# Altium schematic sheet CHipKIT_IO.SchDoc
size A
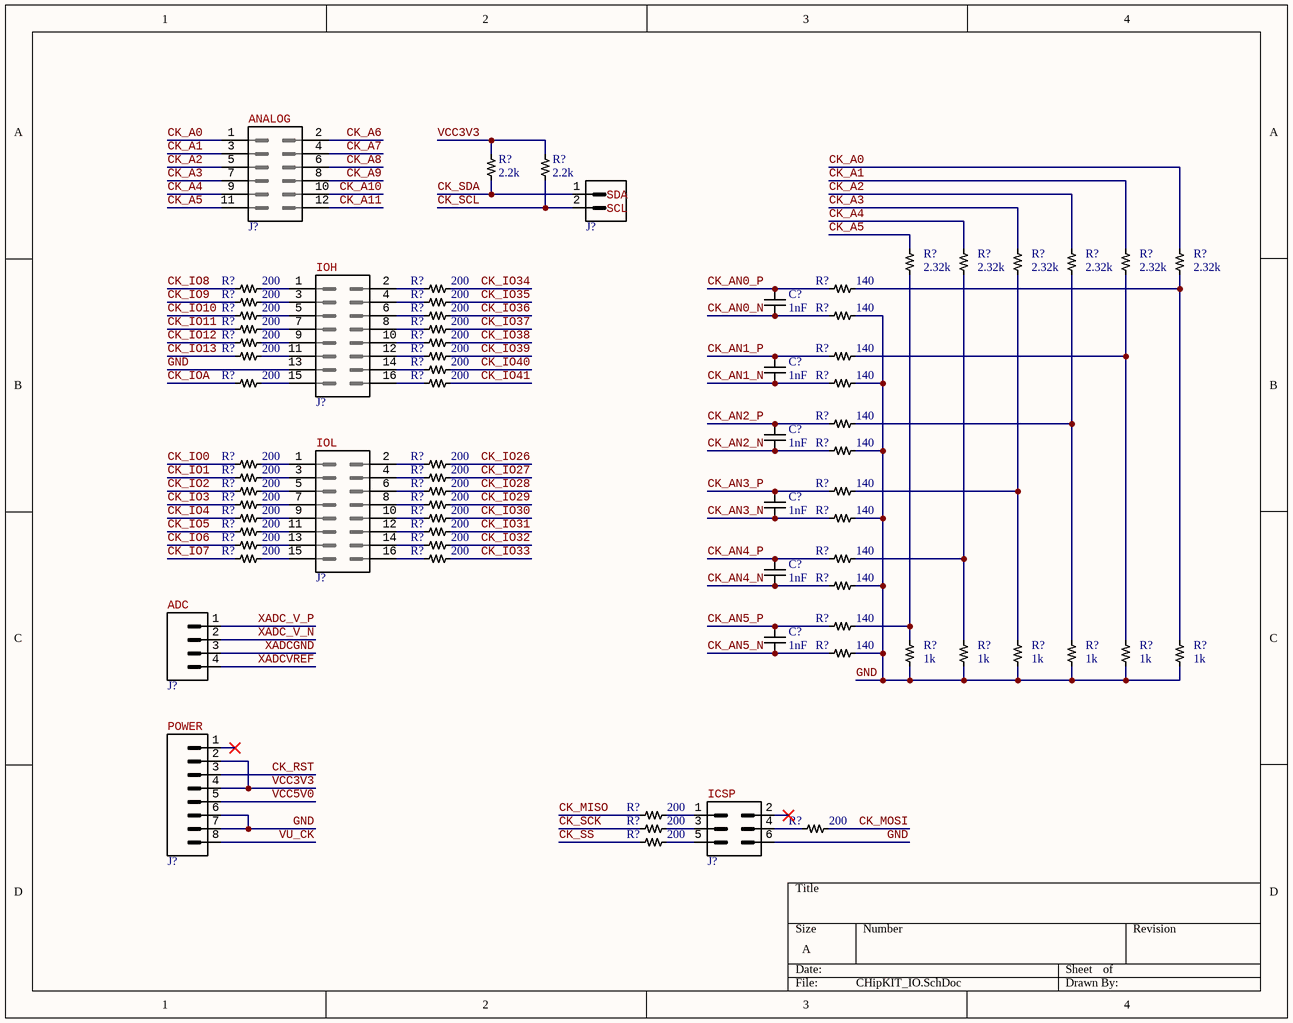
[diagram p0: CHipKIT_IO.SchDoc]

## Parts
(Parts that share a designator on the sheet are numbered #1, #2 ... from top to bottom, then left to right.)
C?#1  1nF  [CAP0402]
C?#2  1nF  [CAP0402]
C?#3  1nF  [CAP0402]
C?#4  1nF  [CAP0402]
C?#5  1nF  [CAP0402]
C?#6  1nF  [CAP0402]
J?#1  2x6 Header  [HEADER_2X6]  (value not drawn)
J?#2  1x2 Header  [HEADER_1X2]  (value not drawn)
J?#3  2x8 Header  [HEADER_2x8]  (value not drawn)
J?#4  2x8 Header  [HEADER_2x8]  (value not drawn)
J?#5  1x4 Header  [HEADER_1X4]  (value not drawn)
J?#6  1x8 Header  [HEADER_1X8]  (value not drawn)
J?#7  2x3 Header  [HEADER_2X3]  (value not drawn)
R?#1  2.2k  [RES0402]
R?#2  2.2k  [RES0402]
R?#3  2.32k  [RES0402]
R?#4  2.32k  [RES0402]
R?#5  2.32k  [RES0402]
R?#6  2.32k  [RES0402]
R?#7  2.32k  [RES0402]
R?#8  2.32k  [RES0402]
R?#9  200  [RES0402]
R?#10  200  [RES0402]
R?#11  140  [RES0402]
R?#12  200  [RES0402]
R?#13  200  [RES0402]
R?#14  200  [RES0402]
R?#15  200  [RES0402]
R?#16  140  [RES0402]
R?#17  200  [RES0402]
R?#18  200  [RES0402]
R?#19  200  [RES0402]
R?#20  200  [RES0402]
R?#21  200  [RES0402]
R?#22  200  [RES0402]
R?#23  140  [RES0402]
R?#24  200  [RES0402]
R?#25  200  [RES0402]
R?#26  200  [RES0402]
R?#27  140  [RES0402]
R?#28  140  [RES0402]
R?#29  140  [RES0402]
R?#30  200  [RES0402]
R?#31  200  [RES0402]
R?#32  200  [RES0402]
R?#33  200  [RES0402]
R?#34  200  [RES0402]
R?#35  200  [RES0402]
R?#36  140  [RES0402]
R?#37  200  [RES0402]
R?#38  200  [RES0402]
R?#39  200  [RES0402]
R?#40  200  [RES0402]
R?#41  140  [RES0402]
R?#42  200  [RES0402]
R?#43  200  [RES0402]
R?#44  200  [RES0402]
R?#45  200  [RES0402]
R?#46  200  [RES0402]
R?#47  200  [RES0402]
R?#48  140  [RES0402]
R?#49  140  [RES0402]
R?#50  140  [RES0402]
R?#51  140  [RES0402]
R?#52  1k  [RES0402]
R?#53  1k  [RES0402]
R?#54  1k  [RES0402]
R?#55  1k  [RES0402]
R?#56  1k  [RES0402]
R?#57  1k  [RES0402]
R?#58  200  [RES0402]
R?#59  200  [RES0402]
R?#60  200  [RES0402]
R?#61  200  [RES0402]

## Nets
CK_A0: J?#1.1 R?#8.2
CK_A1: J?#1.3 R?#7.2
CK_A2: J?#1.5 R?#6.2
CK_A3: J?#1.7 R?#5.2
CK_A4: J?#1.9 R?#4.2
CK_A5: J?#1.11 R?#3.2
CK_A6: J?#1.2
CK_A7: J?#1.4
CK_A8: J?#1.6
CK_A9: J?#1.8
CK_A10: J?#1.10
CK_A11: J?#1.12
CK_AN0_N: C?#1.2 R?#16.1
CK_AN0_P: C?#1.1 R?#11.1
CK_AN1_N: C?#2.2 R?#27.1
CK_AN1_P: C?#2.1 R?#23.1
CK_AN2_N: C?#3.2 R?#29.1
CK_AN2_P: C?#3.1 R?#28.1
CK_AN3_N: C?#4.2 R?#41.1
CK_AN3_P: C?#4.1 R?#36.1
CK_AN4_N: C?#5.2 R?#49.1
CK_AN4_P: C?#5.1 R?#48.1
CK_AN5_N: C?#6.2 R?#51.1
CK_AN5_P: C?#6.1 R?#50.1
CK_IO0: R?#30.1
CK_IO1: R?#32.1
CK_IO2: R?#34.1
CK_IO3: R?#37.1
CK_IO4: R?#39.1
CK_IO5: R?#42.1
CK_IO6: R?#44.1
CK_IO7: R?#46.1
CK_IO8: R?#9.1
CK_IO9: R?#12.1
CK_IO10: R?#14.1
CK_IO11: R?#17.1
CK_IO12: R?#19.1
CK_IO13: R?#21.1
CK_IO26: R?#31.2
CK_IO27: R?#33.2
CK_IO28: R?#35.2
CK_IO29: R?#38.2
CK_IO30: R?#40.2
CK_IO31: R?#43.2
CK_IO32: R?#45.2
CK_IO33: R?#47.2
CK_IO34: R?#10.2
CK_IO35: R?#13.2
CK_IO36: R?#15.2
CK_IO37: R?#18.2
CK_IO38: R?#20.2
CK_IO39: R?#22.2
CK_IO40: R?#24.2
CK_IO41: R?#26.2
CK_IOA: R?#25.1
CK_MISO: R?#58.1
CK_MOSI: R?#60.2
CK_RST: J?#6.3
CK_SCK: R?#59.1
CK_SCL: J?#2.2 R?#2.1
CK_SDA: J?#2.1 R?#1.1
CK_SS: R?#61.1
GND: J?#3.13 J?#6.6 J?#6.7 J?#7.6 R?#16.2 R?#27.2 R?#29.2 R?#41.2 R?#49.2 R?#51.2 R?#52.1 R?#53.1 R?#54.1 R?#55.1 R?#56.1 R?#57.1
VCC3V3: J?#6.2 J?#6.4 R?#1.2 R?#2.2
VCC5V0: J?#6.5
VU_CK: J?#6.8
XADC_V_N: J?#5.2
XADC_V_P: J?#5.1
XADCGND: J?#5.3
XADCVREF: J?#5.4
NetJ?#3_1: J?#3.1 R?#9.2
NetJ?#3_2: J?#3.2 R?#10.1
NetJ?#3_3: J?#3.3 R?#12.2
NetJ?#3_4: J?#3.4 R?#13.1
NetJ?#3_5: J?#3.5 R?#14.2
NetJ?#3_6: J?#3.6 R?#15.1
NetJ?#3_7: J?#3.7 R?#17.2
NetJ?#3_8: J?#3.8 R?#18.1
NetJ?#3_9: J?#3.9 R?#19.2
NetJ?#3_10: J?#3.10 R?#20.1
NetJ?#3_11: J?#3.11 R?#21.2
NetJ?#3_12: J?#3.12 R?#22.1
NetJ?#3_14: J?#3.14 R?#24.1
NetJ?#3_15: J?#3.15 R?#25.2
NetJ?#3_16: J?#3.16 R?#26.1
NetJ?#4_1: J?#4.1 R?#30.2
NetJ?#4_2: J?#4.2 R?#31.1
NetJ?#4_3: J?#4.3 R?#32.2
NetJ?#4_4: J?#4.4 R?#33.1
NetJ?#4_5: J?#4.5 R?#34.2
NetJ?#4_6: J?#4.6 R?#35.1
NetJ?#4_7: J?#4.7 R?#37.2
NetJ?#4_8: J?#4.8 R?#38.1
NetJ?#4_9: J?#4.9 R?#39.2
NetJ?#4_10: J?#4.10 R?#40.1
NetJ?#4_11: J?#4.11 R?#42.2
NetJ?#4_12: J?#4.12 R?#43.1
NetJ?#4_13: J?#4.13 R?#44.2
NetJ?#4_14: J?#4.14 R?#45.1
NetJ?#4_15: J?#4.15 R?#46.2
NetJ?#4_16: J?#4.16 R?#47.1
NetJ?#7_1: J?#7.1 R?#58.2
NetJ?#7_3: J?#7.3 R?#59.2
NetJ?#7_4: J?#7.4 R?#60.1
NetJ?#7_5: J?#7.5 R?#61.2
NetR?#3_1: R?#3.1 R?#50.2 R?#52.2
NetR?#4_1: R?#4.1 R?#48.2 R?#53.2
NetR?#5_1: R?#5.1 R?#36.2 R?#54.2
NetR?#6_1: R?#6.1 R?#28.2 R?#55.2
NetR?#7_1: R?#7.1 R?#23.2 R?#56.2
NetR?#8_1: R?#8.1 R?#11.2 R?#57.2

Not connected (* = marked no-connect by the designer): J?#6 1*; J?#7 2(4)*

## Notes on the sheet
- (near J?#1) ANALOG
- (near J?#2) SDA
- (near J?#2) SCL
- (near J?#3) IOH
- (near J?#4) IOL
- (near J?#5) ADC
- (near J?#6) POWER
- (near J?#7) ICSP

## Library data of the parts
C?#1-C?#6 = GCM155R71H102KA37D: MLCC 1nF 0402 SMD; Manufacturer: Murata; Voltage Rating: 50V; Tolerance: 10%; Dielectric: X7R; Supplier 1: Digi-Key; Manufacturer Part Number: GCM155R71H102KA37D; Stock 1: 18060146; Pricing 1: 1=0.10000, 10=0.03900, 100=0.01720, 500=0.01228, 1000=0.00965, 2500=0.00878, 5000=0.00807 (USD); RoHS: Yes; Mount: Surface Mount; Case/Package: 0402; Case Code (Metric): 1005; Case Code (Imperial): 0402; Min Operating Temperature: -55°C; Max Operating Temperature: 125°C; Package Quantity: 1; Capacitance: 1nF; Packaging: Tape and Reel; Voltage Rating (DC): 50V; Termination: SMD/SMT; Voltage: 50V; Length: 1mm; Height: 0.5mm; Width: 0.02inch; Thickness: 0.022inch; Depth: 0.5mm; Ratings: AEC-Q200; Radiation Hardening: No; REACH SVHC: No SVHC; Lead Free: Lead Free; ComponentLink1URL: https://datasheet.ciiva.com/130/product-130720.pdf?src-supplier=Digi-Key; ComponentLink1Description: https://datasheet.ciiva.com/130/product-130720.pdf?src-supplier=Digi-Key; ComponentLink2URL: https://datasheet.ciiva.com/18183/getdatasheetpartid-140970-18183520.pdf?src-supplier=Verical; ComponentLink2Description: https://datasheet.ciiva.com/18183/getdatasheetpartid-140970-18183520.pdf?src-supplier=Verical; ComponentLink3URL: https://datasheet.ciiva.com/3778/3103gcm155r71h102ka3723-3778878.pdf?src-supplier=Arrow; ComponentLink3Description: https://datasheet.ciiva.com/3778/3103gcm155r71h102ka3723-3778878.pdf?src-supplier=Arrow; ComponentLink4URL: https://datasheet.ciiva.com/11786/0900766b80ef92d0-11786143.pdf?src-supplier=RSComponents; ComponentLink4Description: https://datasheet.ciiva.com/11786/0900766b80ef92d0-11786143.pdf?src-supplier=RSComponents; ComponentLink5URL: https://datasheet.ciiva.com/16213/product-16213384.pdf?src-supplier=Future+Electronics; ComponentLink5Description: https://datasheet.ciiva.com/16213/product-16213384.pdf?src-supplier=Future+Electronics
J?#1 = PPTC062LFBN-RC: Header Female 2x6 2.54mm; Manufacturer: Sullins; Number of Positions: 12; Connector Type: Header,Socket; Pitch: 0.1inch; Supplier 1: Digi-Key; Manufacturer Part Number: PPTC062LFBN-RC; Stock 1: 4618; Pricing 1: 1=0.79000, 10=0.69100, 100=0.59600, 500=0.48762, 1000=0.43344, 5000=0.39130 (USD); RoHS: Yes; Mount: Through Hole; Color: Black; Contact Plating: Tin; Contact Material: Bronze; Housing Material: Plastic; Package Quantity: 1000; Number of Rows: 2; Packaging: Bulk; Termination: Solder; Length: 15.7mm; Height: 8.5mm; Row Spacing: 0.1inch; Width: 5mm; Lead Free: Lead Free; ComponentLink1URL: https://media.digikey.com/pdf/Data%20Sheets/Sullins%20PDFs/Female_Headers.100_DS.pdf?src-supplier=Digi-Key; ComponentLink1Description: https://media.digikey.com/pdf/Data%20Sheets/Sullins%20PDFs/Female_Headers.100_DS.pdf?src-supplier=Digi-Key; ComponentLink2URL: http://www.sullinscorp.com/catalogs/78_Page80-81_HEADER_.100_2.54mm_FEMALE.pdf?src-supplier=Future+Electronics; ComponentLink2Description: http://www.sullinscorp.com/catalogs/78_Page80-81_HEADER_.100_2.54mm_FEMALE.pdf?src-supplier=Future+Electronics
J?#2 = PPTC021LFBN-RC: Header Female 1x2 2.54mm; Manufacturer: Sullins; Number of Positions: 2; Connector Type: Header,Socket; Pitch: 0.1inch; Supplier 1: Digi-Key; Manufacturer Part Number: PPTC021LFBN-RC; Stock 1: 29257; Pricing 1: 1=0.32000, 10=0.30600, 100=0.21390, 500=0.18334, 1000=0.15278, 5000=0.13095, 10000=0.12610 (USD); RoHS: Yes; Mount: Through Hole; Color: Black; Contact Plating: Tin; Contact Material: Bronze; Housing Material: Plastic; Package Quantity: 1000; Number of Rows: 1; Packaging: Bulk; Termination: Solder; Length: 5.58mm; Height: 8.5mm; Width: 2.5mm; Lead Free: Lead Free; ComponentLink1URL: https://media.digikey.com/pdf/Data%20Sheets/Sullins%20PDFs/Female_Headers.100_DS.pdf?src-supplier=Digi-Key; ComponentLink1Description: https://media.digikey.com/pdf/Data%20Sheets/Sullins%20PDFs/Female_Headers.100_DS.pdf?src-supplier=Digi-Key; ComponentLink2URL: http://www.sullinscorp.com/catalogs/78_Page80-81_HEADER_.100_2.54mm_FEMALE.pdf?src-supplier=Future+Electronics; ComponentLink2Description: http://www.sullinscorp.com/catalogs/78_Page80-81_HEADER_.100_2.54mm_FEMALE.pdf?src-supplier=Future+Electronics
J?#3 J?#4 = PPTC082LFBN-RC: Header Female 2x8 2.54mm; Manufacturer: Sullins; Number of Positions: 16; Connector Type: Header,Socket; Pitch: 0.1inch; Supplier 1: Digi-Key; Manufacturer Part Number: PPTC082LFBN-RC; Stock 1: 5065; Pricing 1: 1=0.99000, 10=0.87000, 100=0.75040, 500=0.61398, 1000=0.54576, 5000=0.49270 (USD); RoHS: Yes; Mount: Through Hole; Color: Black; Contact Plating: Tin; Contact Material: Bronze; Housing Material: Plastic; Package Quantity: 1000; Number of Rows: 2; Packaging: Bulk; Termination: Solder; Length: 20.8mm; Height: 8.5mm; Row Spacing: 0.1inch; Width: 5mm; Lead Free: Lead Free; ComponentLink1URL: http://www.sullinscorp.com/catalogs/101_Page80-81_HEADER_.100_2.54mm_FEMALE.pdf?src-supplier=Future+Electronics; ComponentLink1Description: http://www.sullinscorp.com/catalogs/101_Page80-81_HEADER_.100_2.54mm_FEMALE.pdf?src-supplier=Future+Electronics; ComponentLink2URL: https://drawings-pdf.s3.amazonaws.com/10492.pdf?src-supplier=Digi-Key; ComponentLink2Description: https://drawings-pdf.s3.amazonaws.com/10492.pdf?src-supplier=Digi-Key
J?#5 = PPTC041LFBN-RC: Header Female 1x4 2.54mm; Manufacturer: Sullins; Number of Positions: 4; Connector Type: Header,Socket; Pitch: 0.1inch; Supplier 1: Digi-Key; Manufacturer Part Number: PPTC041LFBN-RC; Stock 1: 5302; Pricing 1: 1=0.45000, 10=0.42400, 100=0.32500, 500=0.28260, 1000=0.23315, 5000=0.20489, 10000=0.20410 (USD); RoHS: Yes; Mount: Through Hole; Color: Black; Contact Plating: Tin; Contact Material: Bronze; Housing Material: Plastic; Package Quantity: 1000; Number of Rows: 1; Packaging: Bulk; Termination: Solder; Length: 10.7mm; Height: 8.5mm; Width: 2.5mm; Lead Free: Lead Free; ComponentLink1URL: https://media.digikey.com/pdf/Data%20Sheets/Sullins%20PDFs/Female_Headers.100_DS.pdf?src-supplier=Digi-Key; ComponentLink1Description: https://media.digikey.com/pdf/Data%20Sheets/Sullins%20PDFs/Female_Headers.100_DS.pdf?src-supplier=Digi-Key; ComponentLink2URL: http://www.sullinscorp.com/catalogs/78_Page80-81_HEADER_.100_2.54mm_FEMALE.pdf?src-supplier=Future+Electronics; ComponentLink2Description: http://www.sullinscorp.com/catalogs/78_Page80-81_HEADER_.100_2.54mm_FEMALE.pdf?src-supplier=Future+Electronics
J?#6 = PPTC081LFBN-RC: Header Female 1x8 2.54mm; Manufacturer: Sullins; Number of Positions: 8; Connector Type: Header,Socket; Pitch: 0.1inch; Supplier 1: Future Electronics; Manufacturer Part Number: PPTC081LFBN-RC; Stock 1: 2015; Pricing 1: 1=0.59500, 100=0.42000, 300=0.39000, 1000=0.35500, 3000=0.32500 (USD); RoHS: Yes; Mount: Through Hole; Color: Black; Contact Plating: Tin; Contact Material: Bronze; Housing Material: Plastic; Package Quantity: 1000; Number of Rows: 1; Packaging: Bulk; Termination: Solder; Length: 20.8mm; Height: 8.5mm; Width: 2.5mm; Lead Free: Lead Free; ComponentLink1URL: https://media.digikey.com/pdf/Data%20Sheets/Sullins%20PDFs/Female_Headers.100_DS.pdf?src-supplier=Digi-Key; ComponentLink1Description: https://media.digikey.com/pdf/Data%20Sheets/Sullins%20PDFs/Female_Headers.100_DS.pdf?src-supplier=Digi-Key; ComponentLink2URL: http://www.sullinscorp.com/catalogs/78_Page80-81_HEADER_.100_2.54mm_FEMALE.pdf?src-supplier=Future+Electronics; ComponentLink2Description: http://www.sullinscorp.com/catalogs/78_Page80-81_HEADER_.100_2.54mm_FEMALE.pdf?src-supplier=Future+Electronics
J?#7 = PREC003DAAN-RC: Header Male 2x3 2.54mm
R?#1 R?#2 = RC0402FR-072K2L: Resistor 2.2kOhm 0402 SMD; Manufacturer: Yageo; Resistance: 2.2kR; Tolerance: 1%; Power Rating: 63mW; Voltage Rating: 50V; Temperature Coefficient: 100ppm/°C; Supplier 1: Digi-Key; Manufacturer Part Number: RC0402FR-072K2L; Stock 1: 12789871; Pricing 1: 1=0.10000, 10=0.01600, 100=0.00670, 1000=0.00301, 2500=0.00261, 5000=0.00215 (USD); RoHS: Yes; Case/Package: 0402; Weight: 2.3E-05oz; Case Code (Imperial): 0402; Case Code (Metric): 1005; Min Operating Temperature: -55°C; Max Operating Temperature: 155°C; Composition: Thick Film; Packaging: Tape and Reel; Termination: SMD/SMT; Military Standard: Not; Length: 1mm; Height: 0.35mm; Width: 0.5mm; Depth: 0.5mm; REACH SVHC: Unknown; Lead Free: Lead Free; ComponentLink1URL: https://datasheet.ciiva.com/11808/0900766b80c66297-11808786.pdf?src-supplier=RSComponents; ComponentLink1Description: https://datasheet.ciiva.com/11808/0900766b80c66297-11808786.pdf?src-supplier=RSComponents; ComponentLink2URL: https://datasheet.ciiva.com/12577/pyu-rc0402-51-rohs-l-6-r-12577429.pdf?src-supplier=Mouser; ComponentLink2Description: https://datasheet.ciiva.com/12577/pyu-rc0402-51-rohs-l-6-r-12577429.pdf?src-supplier=Mouser; ComponentLink3URL: https://datasheet.ciiva.com/16741/pyu-rc0402-51-rohs-l-6-r-16741015.pdf?src-supplier=Future+Electronics; ComponentLink3Description: https://datasheet.ciiva.com/16741/pyu-rc0402-51-rohs-l-6-r-16741015.pdf?src-supplier=Future+Electronics; ComponentLink4URL: https://datasheet.ciiva.com/46383/1018594-46383563.pdf?src-supplier=Element14; ComponentLink4Description: https://datasheet.ciiva.com/46383/1018594-46383563.pdf?src-supplier=Element14; ComponentLink5URL: https://datasheet.ciiva.com/7849/1018594-7849928.pdf?src-supplier=Element14; ComponentLink5Description: https://datasheet.ciiva.com/7849/1018594-7849928.pdf?src-supplier=Element14; ComponentLink6URL: https://datasheet.ciiva.com/7849/1018594-7849929.pdf?src-supplier=Element14; ComponentLink6Description: https://datasheet.ciiva.com/7849/1018594-7849929.pdf?src-supplier=Element14; ComponentLink7URL: https://datasheet.ciiva.com/7983/1018594-7983515.pdf?src-supplier=Element14; ComponentLink7Description: https://datasheet.ciiva.com/7983/1018594-7983515.pdf?src-supplier=Element14
R?#3-R?#8 = RC0402FR-072K32L: Resistor 2.32kOhm 0402 SMD; Manufacturer: Yageo; Resistance: 2.32kR; Tolerance: 1%; Temperature Coefficient: 100ppm/°C; Power Rating: 62.5mW; Voltage Rating: 50V; Max Power Dissipation: 63mW; Supplier 1: Digi-Key; Manufacturer Part Number: RC0402FR-072K32L; Stock 1: 522393; Pricing 1: 1=0.10000, 10=0.01600, 100=0.00670, 1000=0.00301, 2500=0.00261, 5000=0.00215 (USD); RoHS: Yes; Case/Package: 0402; Contact Plating: Tin,Matte; Case Code (Imperial): 0402; Case Code (Metric): 1005; Min Operating Temperature: -55°C; Max Operating Temperature: 155°C; Composition: Thick Film; Packaging: Tape and Reel; Number of Terminations: 2; Termination: SMD/SMT; Military Standard: Not; Features: Moisture Resistant; Length: 1mm; Height: 0.016inch; Width: 0.02inch; Depth: 0.5mm; ComponentLink1URL: https://datasheet.ciiva.com/8894/pyu-rc0402-51-rohs-l-6-8894485.pdf?src-supplier=Avnet; ComponentLink1Description: https://datasheet.ciiva.com/8894/pyu-rc0402-51-rohs-l-6-8894485.pdf?src-supplier=Avnet; ComponentLink2URL: https://datasheet.ciiva.com/12560/pyu-rc0402-51-rohs-l-6-r-8721-12560570.pdf?src-supplier=Mouser; ComponentLink2Description: https://datasheet.ciiva.com/12560/pyu-rc0402-51-rohs-l-6-r-8721-12560570.pdf?src-supplier=Mouser; ComponentLink3URL: https://datasheet.ciiva.com/28415/pyu-rc0402-51-rohs-l-6-28415007.pdf?src-supplier=Avnet+Europe; ComponentLink3Description: https://datasheet.ciiva.com/28415/pyu-rc0402-51-rohs-l-6-28415007.pdf?src-supplier=Avnet+Europe
R?#9 R?#10 R?#12-R?#15 R?#17-R?#22 R?#24-R?#26 R?#30-R?#35 R?#37-R?#40 R?#42-R?#47 R?#58-R?#61 = RC0402FR-07200RL: Resistor 200Ohm 0402 SMD; Manufacturer: Yageo; Tolerance: 1%; Temperature Coefficient: 100ppm/°C; Resistance: 200R; Power Rating: 63mW; Voltage Rating (DC): 50V; Supplier 1: Digi-Key; Manufacturer Part Number: RC0402FR-07200RL; Stock 1: 6380122; Pricing 1: 1=0.10000, 10=0.01600, 100=0.00670, 1000=0.00301, 2500=0.00261, 5000=0.00215 (USD); RoHS: Yes; Case/Package: 0402; Case Code (Metric): 1005; Case Code (Imperial): 0402; Min Operating Temperature: -55°C; Max Operating Temperature: 155°C; Composition: Thick Film; Packaging: Tape and Reel; Voltage Rating: 50V; Package Quantity: 1; Number of Terminations: 2; Termination: SMD/SMT; Military Standard: Not; Max Power Dissipation: 63mW; Features: Moisture Resistant; Length: 1mm; Height: 0.016inch; Depth: 0.5mm; Width: 0.02inch; REACH SVHC: No SVHC; Lead Free: Lead Free; ComponentLink1URL: https://datasheet.ciiva.com/16804/pyu-rc0402-51-rohs-l-6-r-16804406.pdf?src-supplier=Future+Electronics; ComponentLink1Description: https://datasheet.ciiva.com/16804/pyu-rc0402-51-rohs-l-6-r-16804406.pdf?src-supplier=Future+Electronics; ComponentLink2URL: https://datasheet.ciiva.com/5562/pyu-rc0402-51-rohs-l-6-r-8721-5562539.pdf?src-supplier=Mouser; ComponentLink2Description: https://datasheet.ciiva.com/5562/pyu-rc0402-51-rohs-l-6-r-8721-5562539.pdf?src-supplier=Mouser; ComponentLink3URL: https://datasheet.ciiva.com/2553/pyu-r-int-thick-7-2553232.pdf?src-supplier=Digi-Key; ComponentLink3Description: https://datasheet.ciiva.com/2553/pyu-r-int-thick-7-2553232.pdf?src-supplier=Digi-Key; ComponentLink4URL: https://datasheet.ciiva.com/7983/1018594-7983509.pdf?src-supplier=Element14; ComponentLink4Description: https://datasheet.ciiva.com/7983/1018594-7983509.pdf?src-supplier=Element14; ComponentLink5URL: https://datasheet.ciiva.com/15189/getdatasheetpartid-331152-15189383.pdf?src-supplier=Verical; ComponentLink5Description: https://datasheet.ciiva.com/15189/getdatasheetpartid-331152-15189383.pdf?src-supplier=Verical; ComponentLink6URL: https://datasheet.ciiva.com/7849/1018594-7849898.pdf?src-supplier=Element14; ComponentLink6Description: https://datasheet.ciiva.com/7849/1018594-7849898.pdf?src-supplier=Element14; ComponentLink7URL: https://datasheet.ciiva.com/7849/1018594-7849899.pdf?src-supplier=Element14; ComponentLink7Description: https://datasheet.ciiva.com/7849/1018594-7849899.pdf?src-supplier=Element14; ComponentLink8URL: https://datasheet.ciiva.com/2553/pyu-r-int-thick-7-2553230.pdf?src-supplier=Digi-Key; ComponentLink8Description: https://datasheet.ciiva.com/2553/pyu-r-int-thick-7-2553230.pdf?src-supplier=Digi-Key; ComponentLink9URL: https://datasheet.ciiva.com/2553/pyu-r-int-thick-7-2553231.pdf?src-supplier=Digi-Key; ComponentLink9Description: https://datasheet.ciiva.com/2553/pyu-r-int-thick-7-2553231.pdf?src-supplier=Digi-Key
R?#11 R?#16 R?#23 R?#27-R?#29 R?#36 R?#41 R?#48-R?#51 = RC0402FR-07140RL: Resistor 140Ohm 0420 SMD; Manufacturer: Yageo; Resistance: 140R; Tolerance: 1%; Temperature Coefficient: 100ppm/°C; Power Rating: 62.5mW; Voltage Rating: 50V; Supplier 1: Digi-Key; Manufacturer Part Number: RC0402FR-07140RL; Stock 1: 485729; Pricing 1: 1=0.10000, 10=0.01600, 100=0.00670, 1000=0.00301, 2500=0.00261, 5000=0.00215 (USD); RoHS: Yes; Case/Package: 0402; Weight: 2.3E-05oz; Contact Plating: Tin,Matte; Case Code (Imperial): 0402; Case Code (Metric): 1005; Min Operating Temperature: -55°C; Max Operating Temperature: 155°C; Composition: Thick Film; Packaging: Tape and Reel; Termination: SMD/SMT; Military Standard: Not; Voltage Rating (DC): 50V; Working Voltage: 50V; Number of Terminations: 2; Length: 1mm; Height: 0.35mm; Width: 0.5mm; Depth: 0.5mm; Lead Free: Lead Free; ComponentLink1URL: https://datasheet.ciiva.com/16744/pyu-rc0402-51-rohs-l-6-r-16744011.pdf?src-supplier=Future+Electronics; ComponentLink1Description: https://datasheet.ciiva.com/16744/pyu-rc0402-51-rohs-l-6-r-16744011.pdf?src-supplier=Future+Electronics; ComponentLink2URL: https://datasheet.ciiva.com/16869/pyu-rc0402-51-rohs-l-6-16869934.pdf?src-supplier=Avnet+Europe; ComponentLink2Description: https://datasheet.ciiva.com/16869/pyu-rc0402-51-rohs-l-6-16869934.pdf?src-supplier=Avnet+Europe; ComponentLink3URL: https://datasheet.ciiva.com/5595/pyu-rc0402-51-rohs-l-6-r-5595957.pdf?src-supplier=Mouser; ComponentLink3Description: https://datasheet.ciiva.com/5595/pyu-rc0402-51-rohs-l-6-r-5595957.pdf?src-supplier=Mouser; ComponentLink4URL: https://datasheet.ciiva.com/28394/pyu-rc0402-51-rohs-l-6-28394198.pdf?src-supplier=Avnet+Europe; ComponentLink4Description: https://datasheet.ciiva.com/28394/pyu-rc0402-51-rohs-l-6-28394198.pdf?src-supplier=Avnet+Europe; ComponentLink5URL: https://datasheet.ciiva.com/8887/pyu-rc0402-51-rohs-l-6-8887401.pdf?src-supplier=Avnet; ComponentLink5Description: https://datasheet.ciiva.com/8887/pyu-rc0402-51-rohs-l-6-8887401.pdf?src-supplier=Avnet; ComponentLink6URL: https://datasheet.ciiva.com/15189/getdatasheetpartid-323703-15189355.pdf?src-supplier=Verical; ComponentLink6Description: https://datasheet.ciiva.com/15189/getdatasheetpartid-323703-15189355.pdf?src-supplier=Verical
R?#52-R?#57 = RC0402FR-071KL: Resistor 1kOhm 0402 SMD; Manufacturer: Yageo; Tolerance: 1%; Resistance: 1kR; Temperature Coefficient: 100ppm/°C; Voltage Rating (DC): 50V; Power Rating: 62.5mW; Supplier 1: Digi-Key; Manufacturer Part Number: RC0402FR-071KL; Stock 1: 60632232; Pricing 1: 1=0.10000, 10=0.01600, 100=0.00670, 1000=0.00301, 2500=0.00261, 5000=0.00215 (USD); RoHS: Yes; Case/Package: 0402; Number of Pins: 2; Case Code (Imperial): 0402; Case Code (Metric): 1005; Min Operating Temperature: -55°C; Max Operating Temperature: 155°C; Composition: Thick Film; Packaging: Tape and Reel; Voltage Rating: 50V; Termination: SMD/SMT; Military Standard: Not; Length: 1mm; Height: 0.32mm; Width: 0.5mm; Depth: 0.5mm; REACH SVHC: Unknown; Lead Free: Lead Free; ComponentLink1URL: https://datasheet.ciiva.com/11819/0900766b80c66297-11819477.pdf?src-supplier=RSComponents; ComponentLink1Description: https://datasheet.ciiva.com/11819/0900766b80c66297-11819477.pdf?src-supplier=RSComponents; ComponentLink2URL: https://datasheet.ciiva.com/12666/pyu-rc0402-51-rohs-l-6-r-12666741.pdf?src-supplier=Mouser; ComponentLink2Description: https://datasheet.ciiva.com/12666/pyu-rc0402-51-rohs-l-6-r-12666741.pdf?src-supplier=Mouser; ComponentLink3URL: https://datasheet.ciiva.com/17063/pyu-rc0402-51-rohs-l-6-r-17063193.pdf?src-supplier=Future+Electronics; ComponentLink3Description: https://datasheet.ciiva.com/17063/pyu-rc0402-51-rohs-l-6-r-17063193.pdf?src-supplier=Future+Electronics; ComponentLink4URL: https://datasheet.ciiva.com/22747/1018594-22747513.pdf?src-supplier=Element14; ComponentLink4Description: https://datasheet.ciiva.com/22747/1018594-22747513.pdf?src-supplier=Element14; ComponentLink5URL: https://datasheet.ciiva.com/7849/1018594-7849869.pdf?src-supplier=Element14; ComponentLink5Description: https://datasheet.ciiva.com/7849/1018594-7849869.pdf?src-supplier=Element14; ComponentLink6URL: https://datasheet.ciiva.com/7983/1018594-7983502.pdf?src-supplier=Element14; ComponentLink6Description: https://datasheet.ciiva.com/7983/1018594-7983502.pdf?src-supplier=Element14; ComponentLink7URL: https://datasheet.ciiva.com/7849/1018594-7849871.pdf?src-supplier=Element14; ComponentLink7Description: https://datasheet.ciiva.com/7849/1018594-7849871.pdf?src-supplier=Element14